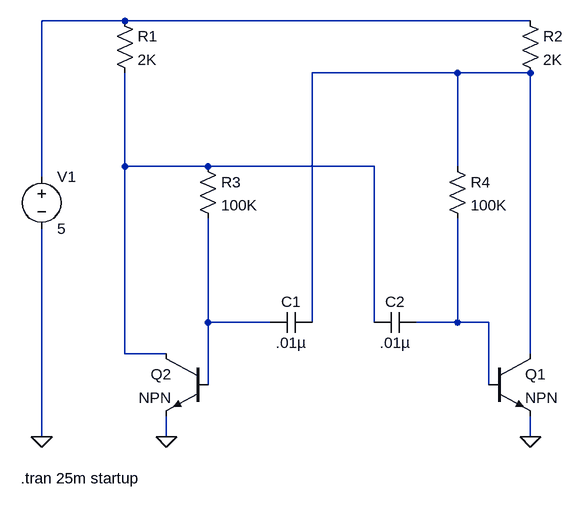
[diagram p0: schematic astable_multivibrator.asc]
astable_multivibrator.asc, the LTspice schematic file:
Version 4
SHEET 1 880 680
WIRE 16 -112 -112 -112
WIRE 640 -112 16 -112
WIRE 528 -32 304 -32
WIRE 640 -32 528 -32
WIRE 16 112 16 -32
WIRE 144 112 16 112
WIRE 400 112 144 112
WIRE 528 112 528 -32
WIRE -112 128 -112 -112
WIRE 144 352 144 192
WIRE 240 352 144 352
WIRE 304 352 304 -32
WIRE 400 352 400 112
WIRE 528 352 528 192
WIRE 528 352 464 352
WIRE 576 352 528 352
WIRE 16 400 16 112
WIRE 80 400 16 400
WIRE 640 400 640 -32
WIRE 144 448 144 352
WIRE 576 448 576 352
WIRE -112 528 -112 208
WIRE 80 528 80 496
WIRE 640 528 640 496
FLAG 640 528 0
FLAG 80 528 0
FLAG -112 528 0
SYMBOL res 0 -128 R0
SYMATTR InstName R1
SYMATTR Value 2K
SYMBOL res 624 -128 R0
SYMATTR InstName R2
SYMATTR Value 2K
SYMBOL res 128 96 R0
SYMATTR InstName R3
SYMATTR Value 100K
SYMBOL res 512 96 R0
SYMATTR InstName R4
SYMATTR Value 100K
SYMBOL cap 304 336 R90
WINDOW 0 0 32 VBottom 2
WINDOW 3 32 32 VTop 2
SYMATTR InstName C1
SYMATTR Value .01µ
SYMBOL cap 464 336 R90
WINDOW 0 0 32 VBottom 2
WINDOW 3 32 32 VTop 2
SYMATTR InstName C2
SYMATTR Value .01µ
SYMBOL npn 576 400 R0
SYMATTR InstName Q1
SYMBOL npn 144 400 M0
SYMATTR InstName Q2
SYMBOL voltage -112 112 R0
SYMATTR InstName V1
SYMATTR Value 5
TEXT -144 592 Left 2 !.tran 25m startup

The netlist it stands for:
* astable_multivibrator.asc
R1 N001 N003 2K
R2 N001 N002 2K
R3 N003 N004 100K
R4 N002 N005 100K
C1 N002 N004 .01µ
C2 N005 N003 .01µ
Q1 N002 N005 0 0 NPN
Q2 N003 N004 0 0 NPN
V1 N001 0 5
.model NPN NPN
.model PNP PNP
.lib standard.bjt
.tran 25m startup
.backanno
.end